# EAGLE design GeigerMuller_shield (EAGLE 7.5.0)
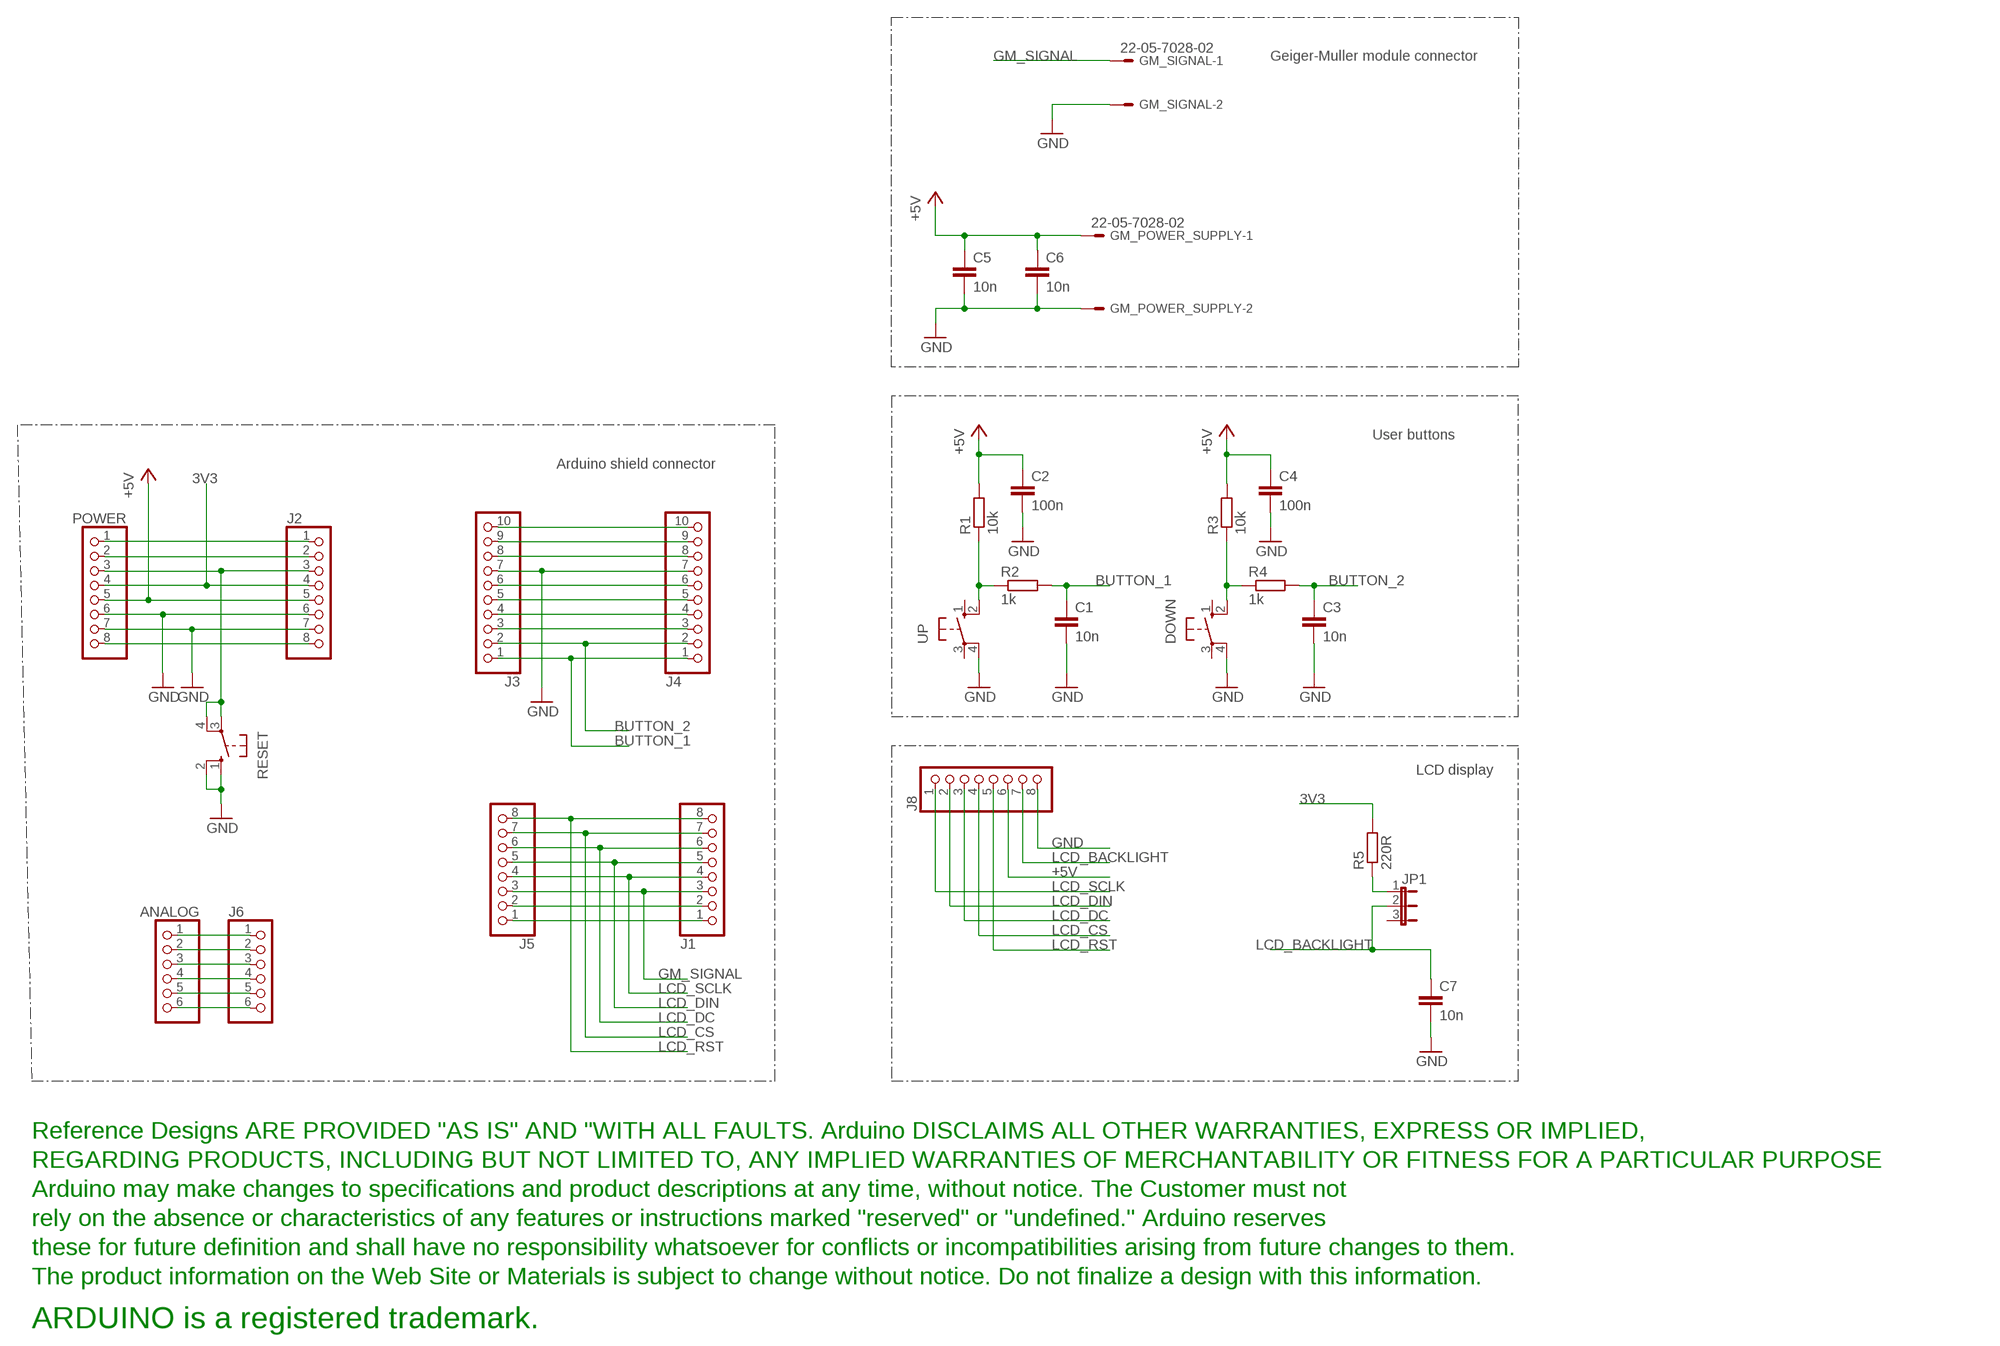
[diagram p0: schematic, sheet 1]

## Parts
ANALOG  PINHD-1X6  [1X06]
C1  10n  C-EUC0805K  [C0805K]
C2  100n  C-EUC0805K  [C0805K]
C3  10n  C-EUC0805K  [C0805K]
C4  100n  C-EUC0805K  [C0805K]
C5  10n  C-EUC0805K  [C0805K]
C6  10n  C-EUC0805K  [C0805K]
C7  10n  C-EUC0805K  [C0805K]
DOWN  10-XX  [B3F-10XX]
GM_POWER_SUPPLY  22-05-7028-02  [7395-02]
GM_SIGNAL  22-05-7028-02  [7395-02]
J1  PINHD-1X8TH  [1X08-TH]
J2  PINHD-1X8TH  [1X08-TH]
J3  PINHD-1X10TH  [1X10-TH]
J4  PINHD-1X10TH  [1X10-TH]
J5  PINHD-1X8TH  [1X08-TH]
J6  PINHD-1X6  [1X06]
J8  PINHD-1X8TH  [1X08-TH]
JP1  JP2E  [JP2]
POWER  PINHD-1X8TH  [1X08-TH]
R1  10k  R-EU_R0805  [R0805]
R2  1k  R-EU_R0805  [R0805]
R3  10k  R-EU_R0805  [R0805]
R4  1k  R-EU_R0805  [R0805]
R5  220R  R-EU_0207/10  [0207/10]
RESET  10-XX  [B3F-10XX]
U$1  DISCLAIMER  [DISCLAIMER]
UP  10-XX  [B3F-10XX]

## Nets
3V3: J2.4 POWER.4 R5.2
+5V: C2.1 C4.1 C5.1 C6.1 GM_POWER_SUPPLY.1 J2.5 J8.6 POWER.5 R1.2 R3.2
+9V: J2.8 POWER.8
BUTTON_1: C1.1 J3.1 J4.1 R2.2
BUTTON_2: C3.1 J3.2 J4.2 R4.2
GM_SIGNAL: GM_SIGNAL.1 J1.3 J5.3
GND: C1.2 C2.2 C3.2 C4.2 C5.2 C6.2 C7.2 DOWN.4(P1) GM_POWER_SUPPLY.2 GM_SIGNAL.2 J2.6 J2.7 J3.7 J4.7 J8.8 POWER.6 POWER.7 RESET.1(S) RESET.2(S1) UP.4(P1)
LCD_BACKLIGHT: C7.1 J8.7 JP1.2
LCD_CS: J1.7 J5.7 J8.4
LCD_DC: J1.6 J5.6 J8.3
LCD_DIN: J1.5 J5.5 J8.2
LCD_RST: J1.8 J5.8 J8.5
LCD_SCLK: J1.4 J5.4 J8.1
N$1: J3.6 J4.6
N$2: J1.2 J5.2
N$3: J3.4 J4.4
N$4: J3.5 J4.5
N$5: R1.1 R2.1 UP.2(S1)
N$6: J1.1 J5.1
N$7: J3.3 J4.3
N$8: JP1.1 R5.1
N$17: DOWN.2(S1) R3.1 R4.1
N$18: ANALOG.1 J6.1
N$19: ANALOG.2 J6.2
N$20: ANALOG.3 J6.3
N$21: ANALOG.4 J6.4
N$22: ANALOG.5 J6.5
N$23: ANALOG.6 J6.6
N$31: J2.2 POWER.2
N$32: J2.1 POWER.1
N$141: J3.9 J4.9
N$142: J3.10 J4.10
N$222: J3.8 J4.8
RESET: J2.3 POWER.3 RESET.3(P) RESET.4(P1)
Unconnected: DOWN.1(S) DOWN.3(P) JP1.3 UP.1(S) UP.3(P)

## Notes on the sheet
- Geiger-Muller module connector
- User buttons
- Arduino shield connector
- LCD display

## Library data of the parts
ANALOG J6 = pinhead:PINHD-1X6: PIN HEADER
C1-C7 = resistor:C-EU: CAPACITOR, European symbol
DOWN RESET UP = switch-omron:10-XX: OMRON SWITCH; MPN: B3F-1000; OC_FARNELL: 176432; OC_NEWARK: 36M3542
GM_POWER_SUPPLY GM_SIGNAL = con-molex:22-?-02: CONNECTOR wire to board 2.54 mm (.1 inch) pitch header; OC_FARNELL: 9731601; OC_NEWARK: unknown
J1 J2 J5 J8 POWER = SmartPrj:PINHD-1X8: PIN HEADER
J3 J4 = SmartPrj:PINHD-1X10: PIN HEADER
JP1 = jumper:JP2E: JUMPER
R1-R5 = resistor:R-EU_: RESISTOR, European symbol
U$1 = SmartPrj:DISCLAIMER

## Board
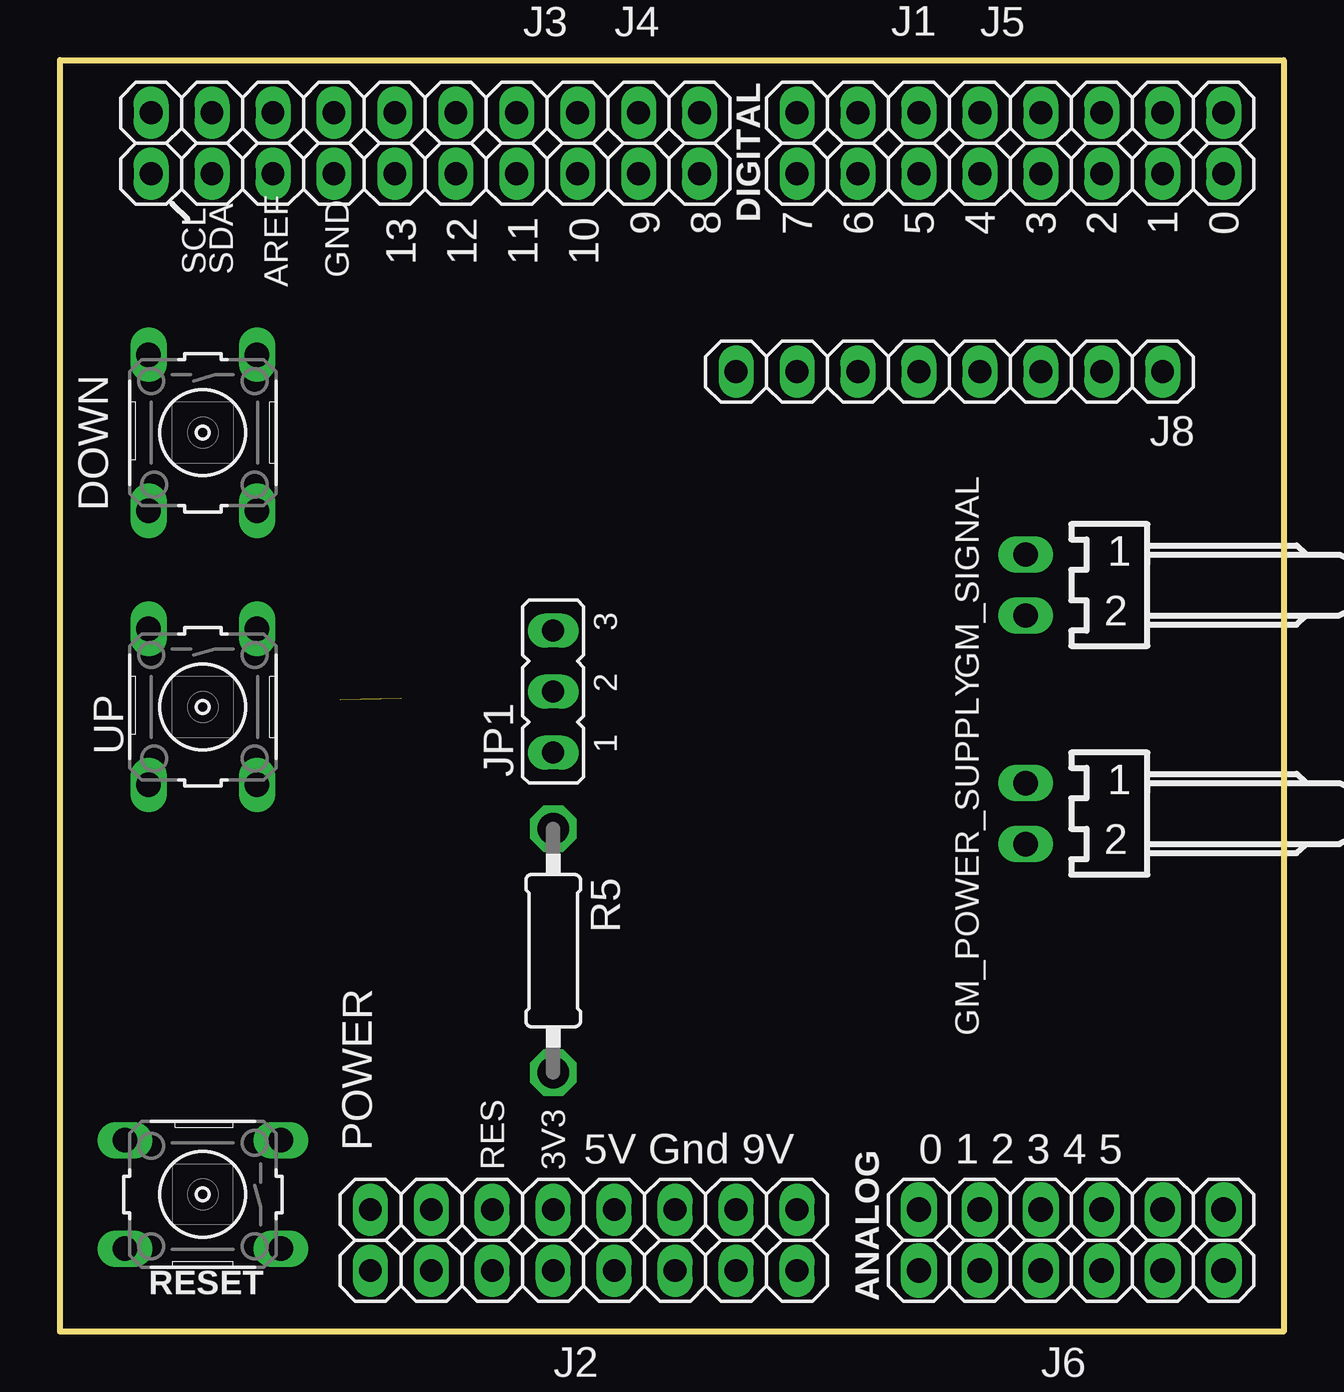
[diagram p1: board, top side]
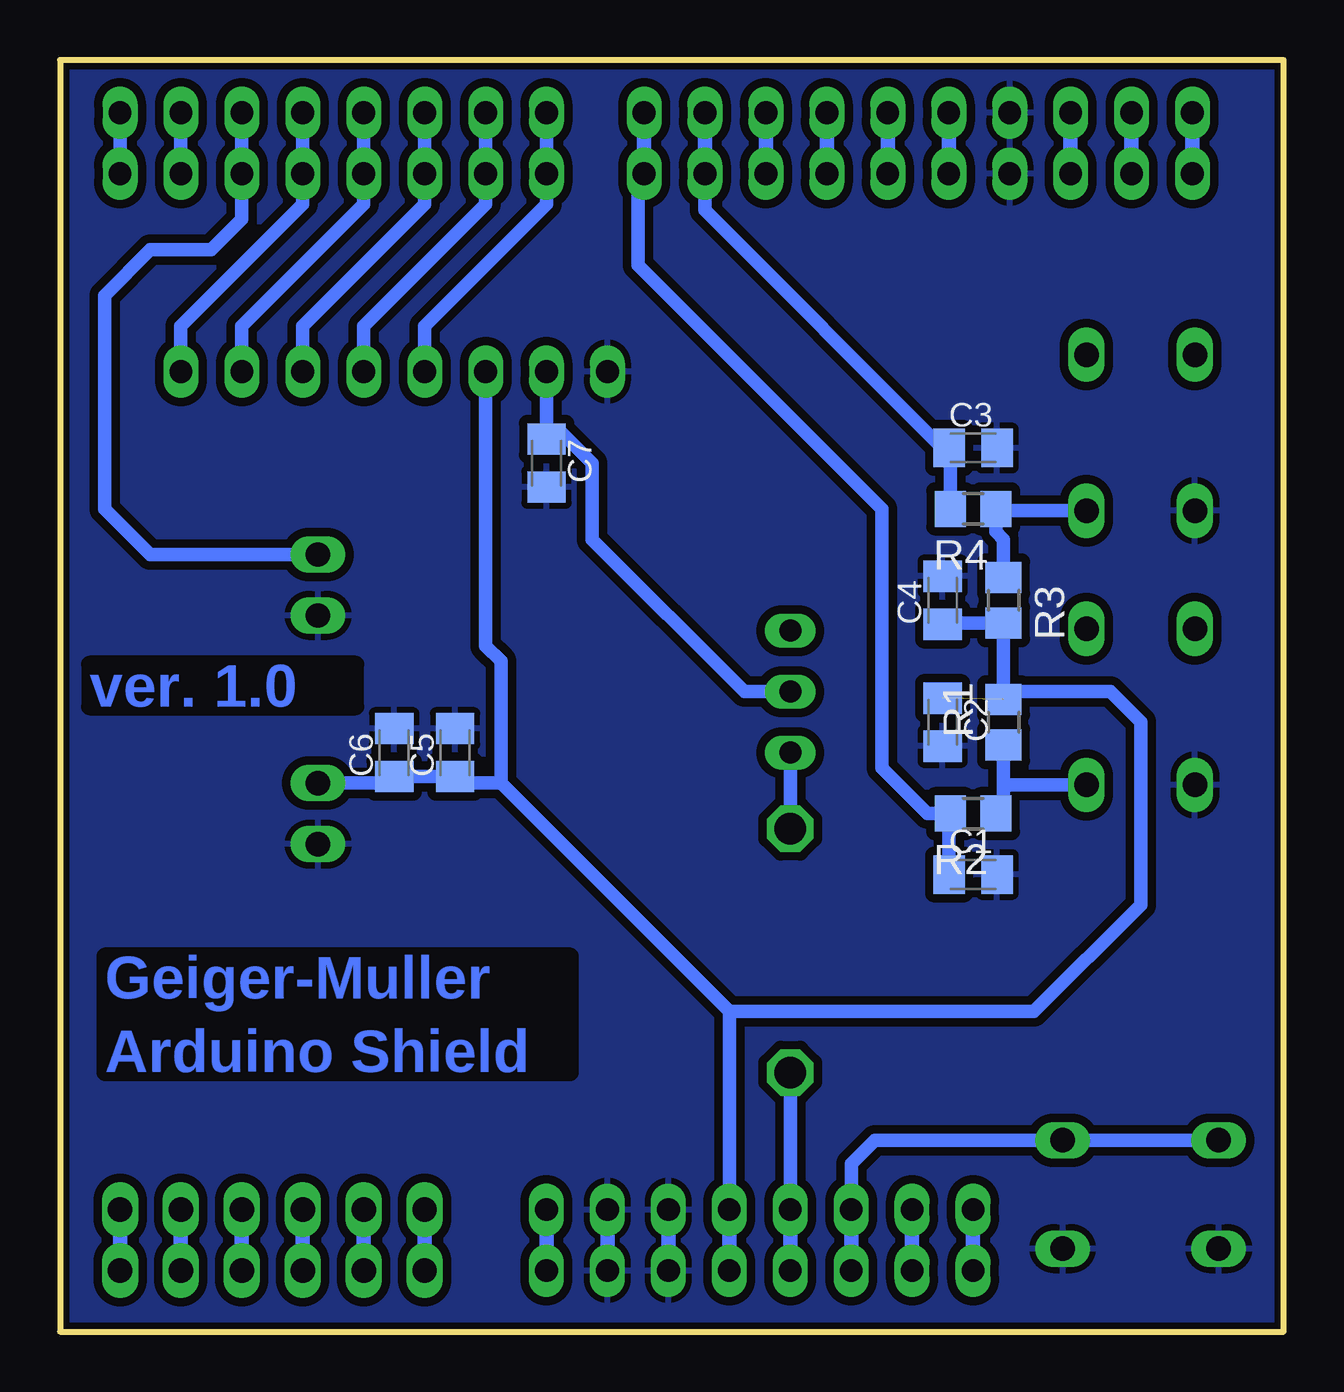
[diagram p2: board, bottom side, seen from below]

Size 51 x 53 mm. Coordinates in mm from the lower left corner, seen from the top.
Outline: 0,53 51,53 51,0 0,0 0,53
Copper layers (1*16): Top 0.035mm / dielectric 1.5mm / Bottom 0.035mm
Design rules "default *": minimum track width 10mil, minimum drill 24mil, track to track 14mil, track to pad 14mil, pad to pad 8mil, via to via 8mil, smd to smd 8mil, copper to edge 10mil, drill to drill 8mil, minimum pad ring 10mil, minimum via ring 8mil, stop-mask expansion 2mil, vias tented up to drill 0mil, thermal gap 10mil

### Footprints (pad centres in the part's own frame; a part is rotated, then mirrored left to right if it is on the bottom)
1X06 = drill 1.016 long: 1 -6.35,0; 2 -3.81,0; 3 -1.27,0; 4 1.27,0; 5 3.81,0; 6 6.35,0
C0805K = smd 1.3 x 1.6: 1 -1,0; 2 1,0
B3F-10XX = drill 1.016 long: 1 -3.251,2.261; 2 3.251,2.261; 3 -3.251,-2.261; 4 3.251,-2.261
7395-02 = drill 1.016 long: 1 1.27,0; 2 -1.27,0
1X08-TH = drill 0.95 pad 1.422 long: 1 -8.89,0; 2 -6.35,0; 3 -3.81,0; 4 -1.27,0; 5 1.27,0; 6 3.81,0; 7 6.35,0; 8 8.89,0
1X10-TH = drill 0.95 pad 1.422 long: 1 -11.43,0; 2 -8.89,0; 3 -6.35,0; 4 -3.81,0; 5 -1.27,0; 6 1.27,0; 7 3.81,0; 8 6.35,0; 9 8.89,0; 10 11.43,0
JP2 = drill 0.914 long: 1 -2.54,0; 2 0,0; 3 2.54,0
R0805 = smd 1.3 x 1.5: 1 -0.95,0; 2 0.95,0
0207/10 = drill 1.3 octagon: 1 -5.08,0; 2 5.08,0

### Placement (x,y rotation side)
ANALOG  42.15,2.54 0 top
C1  12.94,19.05 0 bottom
C2  14.21,25.4 270 bottom
C3  12.94,36.83 0 bottom
C4  14.21,30.48 90 bottom
C5  34.53,24.13 90 bottom
C6  37.07,24.13 90 bottom
C7  30.72,36.2 270 bottom
DOWN  5.95,37.47 270 top
GM_POWER_SUPPLY  40.24,21.59 90 top
GM_SIGNAL  40.24,31.11 90 top
J1  39.61,50.8 180 top
J2  21.83,2.54 0 top
J3  15.23,50.8 180 top
J4  15.23,48.26 180 top
J5  39.61,48.26 180 top
J6  42.15,5.08 0 top
J8  37.07,40.01 180 top
JP1  20.56,26.67 90 top
POWER  21.83,5.08 0 top
R1  11.67,25.4 90 bottom
R2  12.94,21.59 180 bottom
R3  11.67,30.48 270 bottom
R4  12.94,34.29 180 bottom
R5  20.56,15.88 270 top
RESET  5.95,5.71 180 top
U$1  -20.97,-23.11 0 top  (outside the outline)
UP  5.95,26.04 270 top

### Tracks (layer width: path | path; a pad name or v marks a point on that pad's centre or on a via)
3V3
  Bottom 0.559: POWER.4 R5.2
  Bottom 0.61: J2.4 POWER.4
+5V  (1 unrouted)
  Bottom 0.559: C4.1 14.16,29.53 R3.2 R1.2 11.35,26.67 7.23,26.67 5.95,25.4 5.95,17.78 10.4,13.34 23.1,13.34 | GM_POWER_SUPPLY.1 37.34,22.86 C6.1 C5.1 34.26,22.86 32.62,22.86 | POWER.5 23.1,13.34 | 32.62,22.86 23.1,13.34 | J8.6 33.26,28.57 32.62,27.94 32.62,22.86
  Bottom 0.61: POWER.5 J2.5
+9V
  Bottom 0.61: J2.8 POWER.8
BUTTON_1
  Bottom 0.559: C1.1 13.94,21.54 R2.2 14.84,21.59 16.75,23.5 16.75,34.29 26.91,44.45 26.91,48.01 J4.1
  Bottom 0.61: J4.1 J3.1
BUTTON_2
  Bottom 0.559: R4.2 13.89,36.78 C3.1 14.21,36.83 24.12,46.74 J4.2
  Bottom 0.61: J4.2 J3.2
GM_SIGNAL
  Bottom 0.559: J1.3 J5.3 43.42,46.35 44.69,45.09 47.23,45.09 49.14,43.18 49.14,34.29 47.23,32.38 GM_SIGNAL.1
GND
  Bottom 0.61: POWER.7 J2.7 | J2.6 POWER.6
  pour Bottom: 0,53 51,53 51.04,0 0,0
LCD_BACKLIGHT
  Bottom 0.559: J8.7 C7.1 30.45,37.47 30.09,37.47 28.81,36.2 28.81,33.02 22.47,26.67 JP1.2
LCD_CS
  Bottom 0.559: J1.7 J5.7 33.26,46.99 38.34,41.91 J8.4
LCD_DC
  Bottom 0.559: J1.6 J5.6 35.8,46.99 40.88,41.91 J8.3
LCD_DIN
  Bottom 0.559: J1.5 J5.5 38.34,46.99 43.42,41.91 J8.2
LCD_RST
  Bottom 0.559: J1.8 J5.8 30.72,46.99 35.8,41.91 J8.5
LCD_SCLK
  Bottom 0.559: J1.4 J5.4 40.88,46.99 45.96,41.91 J8.1
N$1
  Bottom 0.61: J4.6 J3.6
N$2
  Bottom 0.559: J5.2 J1.2
N$3
  Bottom 0.61: J4.4 J3.4
N$4
  Bottom 0.61: J4.5 J3.5
N$5
  Bottom 0.559: R1.1 11.67,22.86 | 11.67,22.86 11.67,21.91 R2.1 | UP.2 11.59,22.78 11.67,22.86
N$6
  Bottom 0.559: J5.1 J1.1
N$7
  Bottom 0.61: J4.3 J3.3
N$8
  Bottom 0.559: R5.1 JP1.1
N$17
  Bottom 0.559: R3.1 11.67,33.02 11.99,33.34 R4.1 11.91,34.21 DOWN.2
N$18
  Bottom 0.61: ANALOG.1 J6.1
N$19
  Bottom 0.61: ANALOG.2 J6.2
N$20
  Bottom 0.61: ANALOG.3 J6.3
N$21
  Bottom 0.61: ANALOG.4 J6.4
N$22
  Bottom 0.61: ANALOG.5 J6.5
N$23
  Bottom 0.61: ANALOG.6 J6.6
N$31
  Bottom 0.61: J2.2 POWER.2
N$32
  Bottom 0.61: J2.1 POWER.1
N$141
  Bottom 0.61: J4.9 J3.9
N$142
  Bottom 0.61: J4.10 J3.10
N$222
  Bottom 0.61: J4.8 J3.8
RESET
  Bottom 0.559: RESET.4 RESET.3 17.03,7.98 18.02,6.99 POWER.3
  Bottom 0.61: POWER.3 J2.3

### Text on the board
Bottom: ver. 1.0 | Geiger-Muller / Arduino Shield
tPlace: 9 | 8 | 7 | 6 | 5 | 4 | 3 | 2 | 1 | 0 | 13 | 12 | 11 | 10
tNames: DIGITAL | AREF | SCL | SDA | GND | RES | 3V3 | 5V Gnd 9V | 0 1 2 3 4 5
bStop: DIGITAL | SDA | AREF | SCL | GND | 13 | 12 | 11 | 9 | 8 | 7 | 6 | 5 | 4 | 3 | 2 | 1 | 0 | 10 | IOREF | RST | 3.3V | 5V | GND | GND | VIN | ANALOG | 0 | 1 | 2 | 3 | 4